# EasyEDA Pro project LeTian-robot2（轮腿机器人）.eprj, schematic Control-SCH
Create Date: 2022-11-02; Page Name: P1; Project Name: LeTian-robot2（轮腿机器人）; Schematic Name: Control-SCH; Update Date: 2023-05-18; Company: LeTian
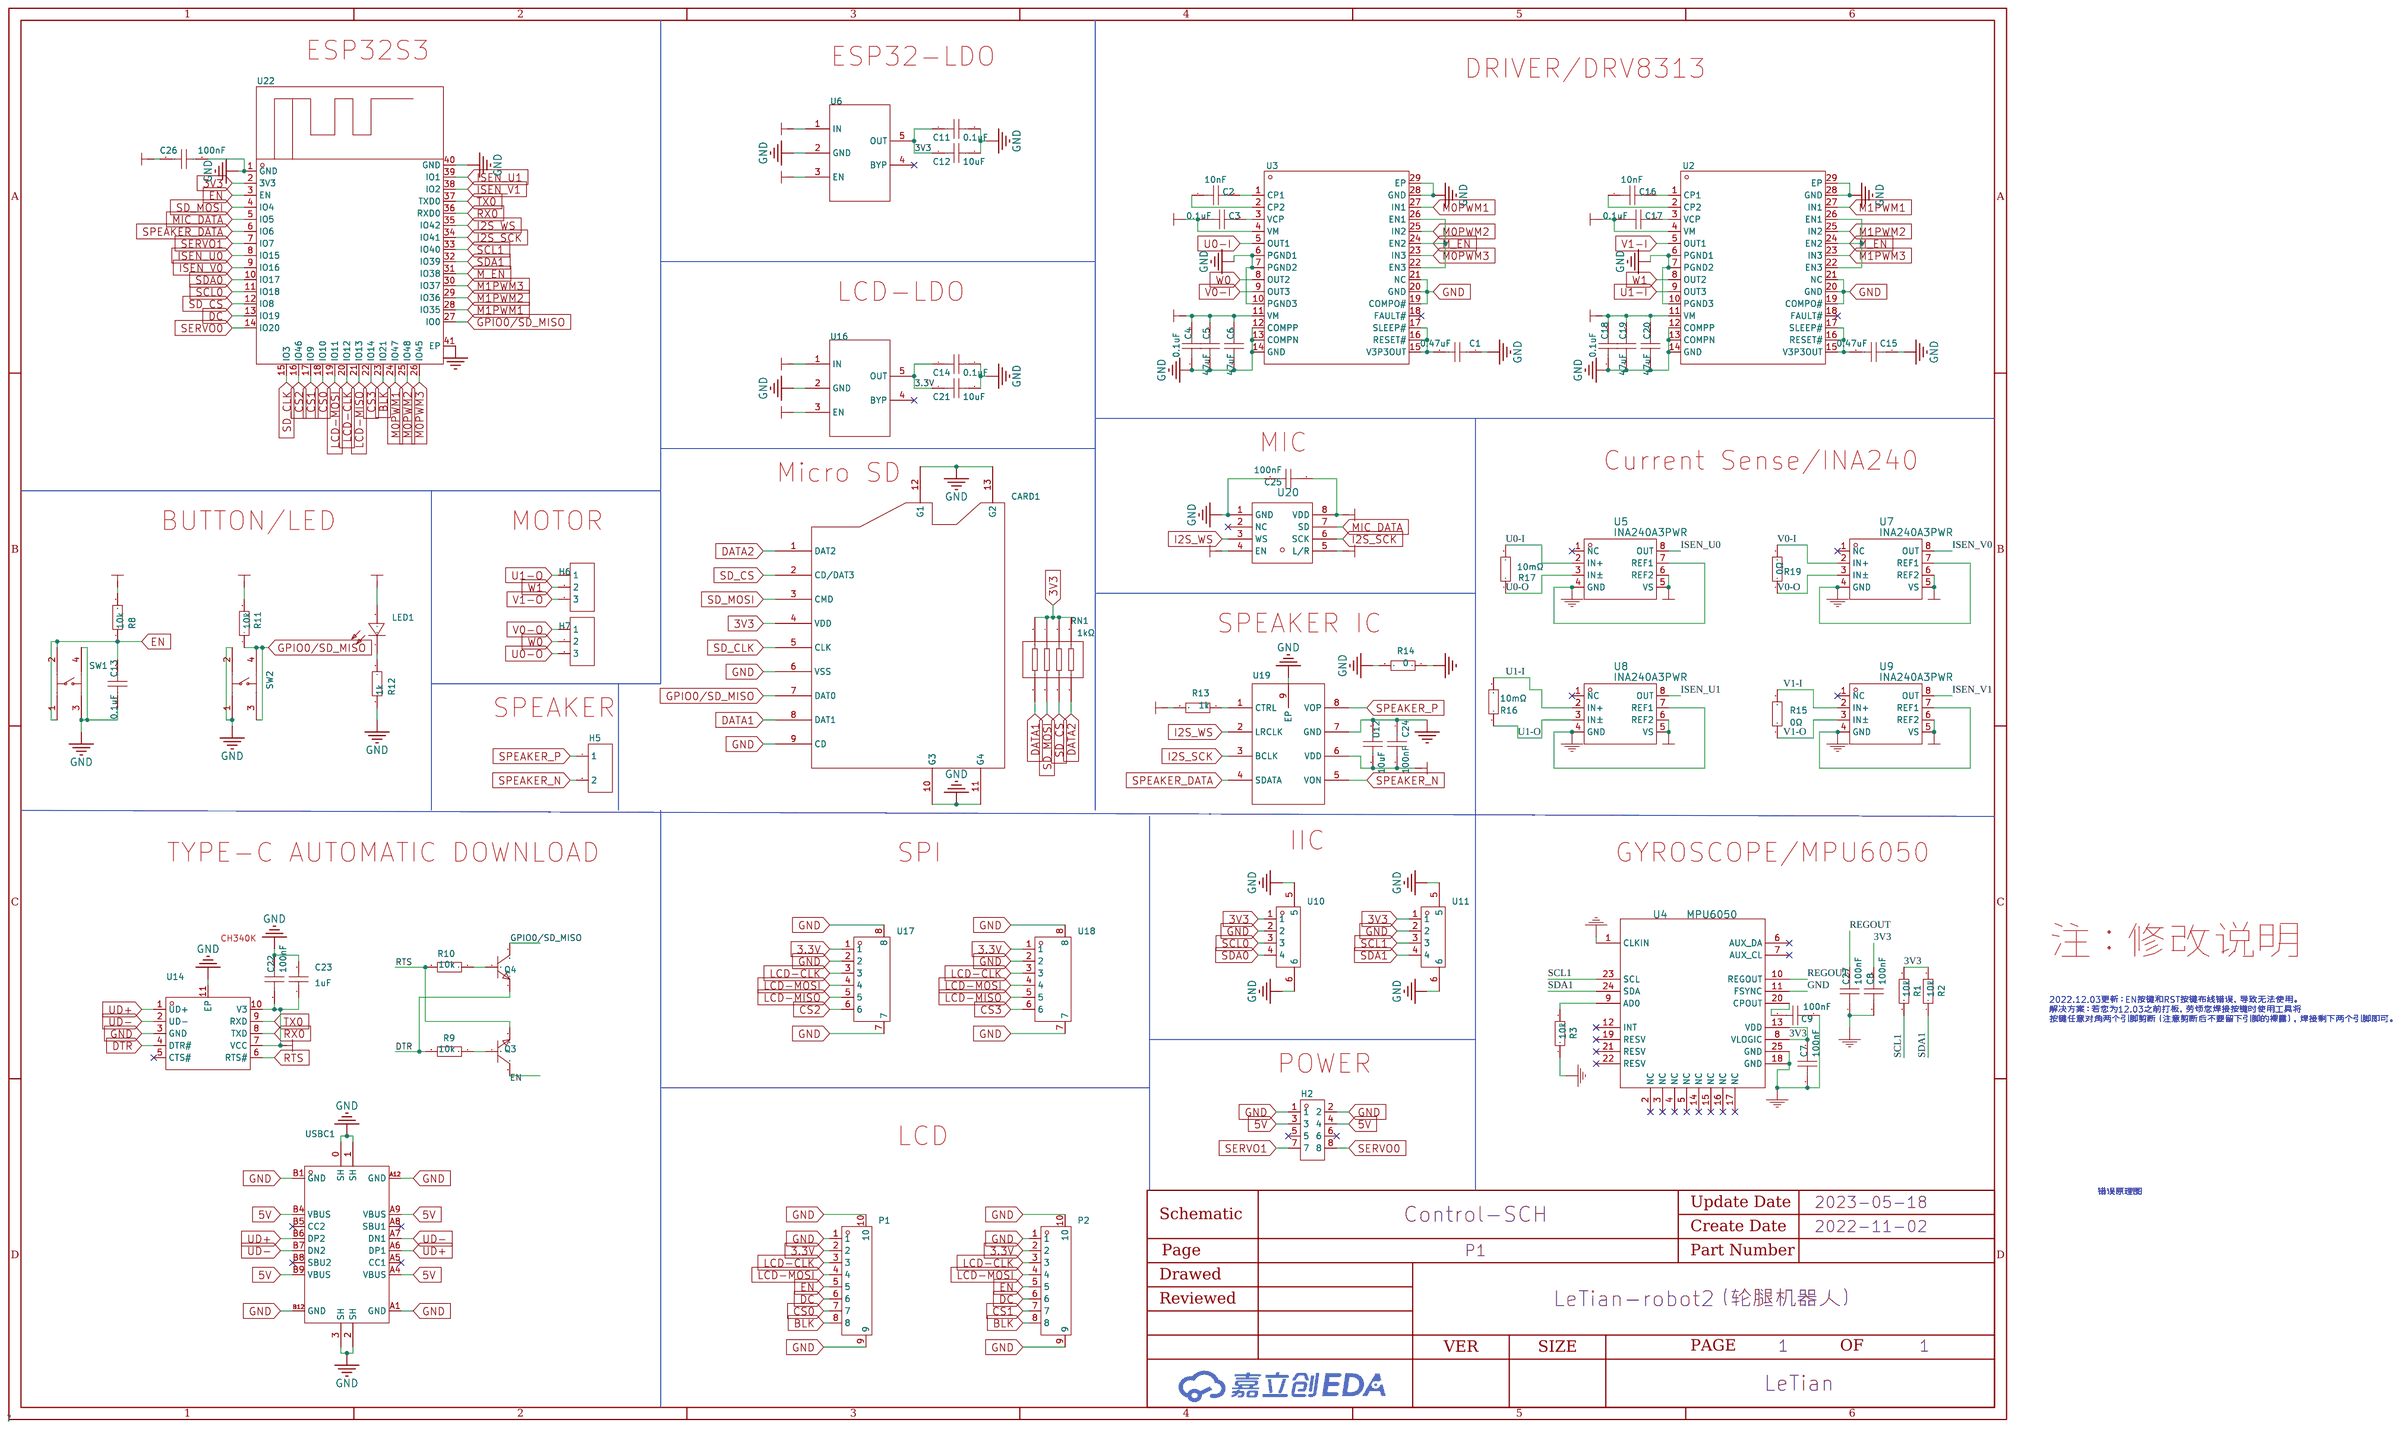
[diagram p1: schematic sheet]

## Parts
C1  0.47uF  [C0603]
C2  10nF  [C0603]
C3  0.1uF  [C0603]
C4  0.1uF  [C0603]
C5  47uF  [C1812]
C6  47uF  [C1812]
C7  100nF  [C0603]
C8  100nF  [C0603]
C9  100nF  [C0603]
C11  0.1uF  [C0603]
C12  10uF  [C0603]
C13  0.1uF  [C0603]
C14  0.1uF  [C0603]
C15  0.47uF  [C0603]
C16  10nF  [C0603]
C17  0.1uF  [C0603]
C18  0.1uF  [C0603]
C19  47uF  [C1812]
C20  47uF  [C1812]
C21  10uF  [C0603]
C22  100nF  [C0603]
C23  1uF  [C0603]
C24  100nF  [C0603]
C25  100nF  [C0603]
C26  100nF  [C0603]
C27  100nF  [C0603]
CARD1  TF-15x15  [TF-SMD_TF-15-15]
H2  2.54-2*4P立贴针  [HDR-SMD_8P-P2.54-V-M-R2-C4-LS7.4]
H5  826629-2  [HDR-TH_2P-P2.54-V-M-1]
H6  2.54-1*3P针  [HDR-TH_3P-P2.54-V-M-1]
H7  2.54-1*3P针  [HDR-TH_3P-P2.54-V-M-1]
LED1  TLMS1100-GS08  [LED0603-RD_RED]
P1  FPC 0.5MM 8P 拉抽式 H2.0mm 下接  [FPC-SMD_8P-P0.50_LSXJ-H2.0-8P]
P2  FPC 0.5MM 8P 拉抽式 H2.0mm 下接  [FPC-SMD_8P-P0.50_LSXJ-H2.0-8P]
Q3  SS8050  [SOT-23-3_L2.9-W1.3-P1.90-LS2.4-BR]
Q4  SS8050  [SOT-23-3_L2.9-W1.3-P1.90-LS2.4-BR]
R1  10k  [R0603]
R2  10k  [R0603]
R3  10k  [R0603]
R8  10k  [R0603]
R9  10k  [R0603]
R10  10k  [R0603]
R11  10k  [R0603]
R12  1k  [R0603]
R13  1k  [R0603]
R14  0  [R0603]
R15  0Ω  [R1206]
R16  10mΩ  [R1206]
R17  10mΩ  [R1206]
R19  0Ω  [R1206]
RN1  1kΩ  [RES-ARRAY-SMD_0603-8P-L3.2-W1.6-BL]
SW1  -  [KEY-SMD_4P-L4.2-W3.2-P2.20-LS5.1-TL]
SW2  -  [KEY-SMD_4P-L4.2-W3.2-P2.20-LS5.1-TL]
U2  DRV8313PWPR  [HTSSOP-28_L9.8-W4.5-P0.65-LS6.6-BL-EP]
U3  DRV8313PWPR  [HTSSOP-28_L9.8-W4.5-P0.65-LS6.6-BL-EP]
U4  MPU6050  [QFN-24_L4.0-W4.0-P0.50-BL-EP2.7]
U5  INA240A3PWR  [TSSOP-8_L4.4-W3.0-P0.65-LS6.4-BL-2]
U6  SPX3819M5-L-3-3/TR  [SOT-23-5_L3.0-W1.7-P0.95-LS2.8-BR]
U7  INA240A3PWR  [TSSOP-8_L4.4-W3.0-P0.65-LS6.4-BL-2]
U8  INA240A3PWR  [TSSOP-8_L4.4-W3.0-P0.65-LS6.4-BL-2]
U9  INA240A3PWR  [TSSOP-8_L4.4-W3.0-P0.65-LS6.4-BL-2]
U10  GH1.25-4PWBPZ  [CONN-SMD_GH1.25-4PWBPZ]
U11  GH1.25-4PWBPZ  [CONN-SMD_GH1.25-4PWBPZ]
U12  10uF  [C0603]
U14  CH340K  [ESOP-10_L4.9-W3.9-P1.00-LS6.2-BL-EP]
U16  SPX3819M5-L-3-3/TR  [SOT-23-5_L3.0-W1.7-P0.95-LS2.8-BR]
U17  1.25-6PWTDK  [CONN-SMD_6P-P1.25_GH1.25-6PWBPZ]
U18  1.25-6PWTDK  [CONN-SMD_6P-P1.25_GH1.25-6PWBPZ]
U19  -  [NS4168-eSOP8]
U20  -  [MSM-MIC]
U22  ESP32-S3-WROOM-1-N8  [WIFIM-SMD_ESP32-S3-WROOM-1-N8]
USBC1  TYPE-C-31-M-12  [USB-C_SMD-TYPE-C-31-M-12]

## Library data of the parts
C1 C15 = CL10B104KB8NNNC: 容值:100nF;精度:±10%;额定电压:50V;材质(温度系数):X7R;; LCSC Part Name: 100nF ±10% 50V; Supplier Part: C694503; Manufacturer: SAMSUNG(三星); Supplier Footprint: 0603; JLCPCB Part Class: Extended Part; Datasheet: https://atta.szlcsc.com/upload/public/pdf/source/20160103/1457707680512.pdf; Supplier: LCSC; Tolerance: ±10%; Voltage Rated: 50V; Temperature Coefficient: X7R
C2 C16 = CL10B104KB8NNNC: 容值:100nF;精度:±10%;额定电压:50V;材质(温度系数):X7R;; LCSC Part Name: 100nF ±10% 50V; Supplier Part: C346187; Manufacturer: SAMSUNG(三星); Supplier Footprint: 0603; JLCPCB Part Class: Extended Part; Datasheet: https://atta.szlcsc.com/upload/public/pdf/source/20160103/1457707680512.pdf; Supplier: LCSC; Tolerance: ±10%; Voltage Rated: 50V; Temperature Coefficient: X7R
C3 C4 C11 C13 C14 C17 C18 = CL10B104KB8NNNC: 容值:100nF;精度:±10%;额定电压:50V;材质(温度系数):X7R;; LCSC Part Name: 100nF ±10% 50V; Supplier Part: C282519; Manufacturer: SAMSUNG(三星); Supplier Footprint: 0603; JLCPCB Part Class: Extended Part; Datasheet: https://atta.szlcsc.com/upload/public/pdf/source/20160103/1457707680512.pdf; Supplier: LCSC; Tolerance: ±10%; Voltage Rated: 50V; Temperature Coefficient: X7R
C5 C6 C19 C20 = FH12X222K302EGG: 等级:X2;容值:2.2nF;精度:±10%;; LCSC Part Name: 等级:X2 2.2nF ±10%; Supplier Part: C342632; Manufacturer: PSA(信昌电陶); Supplier Footprint: 1812; JLCPCB Part Class: Extended Part; Datasheet: https://atta.szlcsc.com/upload/public/pdf/source/20200506/C436246_4EAA78C9048D88437BAF2CB7B8BE45FD.pdf; Supplier: LCSC; Subclass: X2; Tolerance: ±10%
C7-C9 C22 C24-C27 = 0603F104Z500CT_C83060: 容值:100nF;精度:-20%~+80%;额定电压:50V;材质(温度系数):Y5V;; LCSC Part Name: 100nF -20%~+80% 50V; Supplier Part: C282519; Manufacturer: Walsin(华新科); Manufacturer Part: 0603F104Z500CT; Supplier Footprint: 0603; JLCPCB Part Class: Extended Part; Datasheet: https://atta.szlcsc.com/upload/public/pdf/source/20161119/1479540179445.pdf; Supplier: LCSC; Tolerance: -20%~+80%; Voltage Rated: 50V; Temperature Coefficient: Y5V
C12 C21 = CL10B104KB8NNNC: 容值:100nF;精度:±10%;额定电压:50V;材质(温度系数):X7R;; LCSC Part Name: 100nF ±10% 50V; Supplier Part: C669868; Manufacturer: SAMSUNG(三星); Supplier Footprint: 0603; JLCPCB Part Class: Extended Part; Datasheet: https://atta.szlcsc.com/upload/public/pdf/source/20160103/1457707680512.pdf; Supplier: LCSC; Tolerance: ±10%; Voltage Rated: 50V; Temperature Coefficient: X7R
C23 = 0603F105M160NT: 容值:1uF;精度:±20%;额定电压:16V;材质(温度系数):Y5V;; LCSC Part Name: 1uF ±20% 16V; Supplier Part: C1689; Manufacturer: FH(风华); Supplier Footprint: 0603; JLCPCB Part Class: Extended Part; Datasheet: https://atta.szlcsc.com/upload/public/pdf/source/20170923/C1689_1506149319442988473.pdf; Supplier: LCSC; Tolerance: ±20%; Voltage Rated: 16V; Temperature Coefficient: Y5V
CARD1 = TF-15x15: 卡连接方式:自弹式;卡类型:MicroSD卡(TF卡);连接器类型:卡座;本体最大高度:-;触头材质:-;触头镀层:-;工作温度范围:-;焊接温度(最大值):-;; LCSC Part Name: 自弹式 MicroSD卡(TF卡) 卡座; Supplier Part: C111196; Manufacturer: SOFNG(硕方); Supplier Footprint: SMD; JLCPCB Part Class: Extended Part; Datasheet: https://atta.szlcsc.com/upload/public/pdf/source/20200911/C111196_6985EA70490FD8F56A5C3F4D017F3786.pdf; Supplier: LCSC; Card Connection Mode: 自弹式; Card Type: MicroSD卡(TF卡); Connector Type: 卡座
H2 = 2.54-2*4P立贴针: 间距:2.54mm;总PIN位数:8;排数:2;插针结构:-;行距:-;安装类型:-;圆针/方针:-;额定电流:-;额定电压:-;配合针长度:-;塑高:-;触头材质:-;触头镀层:-;颜色:黑色;; LCSC Part Name: 2.54mm; Supplier Part: C192300; Manufacturer: BOOMELE(博穆精密); Supplier Footprint: SMD,P=2.54mm; JLCPCB Part Class: Extended Part; Datasheet: https://atta.szlcsc.com/upload/public/pdf/source/20210812/F9D0E068B6990BF98BEA9D68FBD6ED36.pdf; Supplier: LCSC; Pitch: 2.54mm; Number of Pins: 8; Number of Rows: 2; Color: 黑色
H5 = 826629-2: 间距:2.54mm;总PIN位数:2;排数:1;插针结构:1x2P;行距:-;安装类型:直插;圆针/方针:-;额定电流:-;额定电压:-;配合针长度:-;塑高:2.8mm;触头材质:黄铜;触头镀层:-;颜色:绿色;; LCSC Part Name: 2.54mm 1x2P 直插 分离式  金; Supplier Part: C86471; Manufacturer: TE Connectivity(美国泰科); Supplier Footprint: 插件,P=2.54mm; JLCPCB Part Class: Extended Part; Datasheet: https://atta.szlcsc.com/upload/public/pdf/source/20161105/1478330325829.pdf; Supplier: LCSC; Pitch: 2.54mm; Number of Pins: 2; Number of Rows: 1; Pin Structure: 1x2P; Mounting Type: 直插; Insulation Height: 2.8mm; Contact Material: 黄铜; Color: 绿色
H6 H7 = 2.54-1*3P针: 间距:2.54mm;总PIN位数:3;排数:1;插针结构:1x3P;行距:-;安装类型:直插;圆针/方针:方针;额定电流:3A;额定电压:-;配合针长度:-;塑高:-;端接针长度:-;触头材质:-;触头镀层:-;工作温度范围:-40~+105;颜色:黑色;; LCSC Part Name: 2.54mm 1x3P 直插 方针; Supplier Part: C49257; Manufacturer: BOOMELE(博穆精密); Supplier Footprint: 插件,P=2.54mm; JLCPCB Part Class: Extended Part; Datasheet: https://atta.szlcsc.com/upload/public/pdf/source/20151109/1457707570948.pdf; Supplier: LCSC; Pitch: 2.54mm; Number of Pins: 3; Number of Rows: 1; Pin Structure: 1x3P; Mounting Type: 直插; Circluar Pins/Square Pins: 方针; Current Rating (Max): 3A; Operating Temperature Range: -40~+105; Color: 黑色
LED1 = TLMS1100-GS08: 发光颜色:红灯;; Supplier Part: C965807; Manufacturer: VISHAY(威世); Supplier Footprint: 0603; JLCPCB Part Class: Extended Part; Datasheet: https://atta.szlcsc.com/upload/public/pdf/source/20181008/C266784_DA83D7B059AAF2F8B2E0AECEC66B2294.pdf; Supplier: LCSC; Emitted Color: 红灯
P1 P2 = FPC 0.5MM 8P 拉抽式 H2.0mm 下接: 间距:0.5mm;触点数量:8;锁定特性:抽屉式;安装类型:卧贴;触点类型:下接;; LCSC Part Name: 0.5mm P数:8 抽屉式 下接 停产; Supplier Part: C11049; Manufacturer: BOOMELE(博穆精密); Supplier Footprint: SMD,P=0.5mm; JLCPCB Part Class: Extended Part; Datasheet: https://atta.szlcsc.com/upload/public/pdf/source/20190828/C11049_0B9C6D9328AA774B9FE15F21DB05D521.pdf; Supplier: LCSC; Pitch: 0.5mm; Number of Contacts: 8; Locking Feature: 抽屉式; Mounting Type: 卧贴; Contact Type: 下接; Height Above Board: 2mm
Q3 Q4 = SS8050_C916392: 晶体管类型:-;集射极击穿电压(Vceo):-;集电极电流(Ic):-;功率(Pd):-;集电极截止电流(Icbo):-;集电极-发射极饱和电压(VCE(sat)@Ic,Ib):-;直流电流增益(hFE@Ic,Vce):-;特征频率(fT):-;; Supplier Part: C916392; Manufacturer: JSMSEMI(杰盛微); Supplier Footprint: SOT-23; JLCPCB Part Class: Extended Part; Datasheet: https://atta.szlcsc.com/upload/public/pdf/source/20211201/0A8CEC4FF7E91679BCF495428691A716.pdf; Supplier: LCSC
R1-R3 R8-R13 = TR0603B10K0P0525Z: 电阻类型:薄膜电阻;阻值:10k;精度:±0.1%;功率:100mW;温度系数:±25ppm/;最大工作电压:75V;工作温度范围:-55~+155;; LCSC Part Name: 10k ±0.1% 100mW; Supplier Part: C25804; Manufacturer: EVER OHMS(天二科技); Supplier Footprint: 0603; JLCPCB Part Class: Extended Part; Datasheet: https://atta.szlcsc.com/upload/public/pdf/source/20190415/C188363_433BF05B6FB8F7A0F5F35A3E4390C55A.pdf; Supplier: LCSC; Type: 薄膜电阻; Tolerance: ±0.1%; Power(Watts): 100mW; Temperature Coefficient: ±25ppm/; Overload Voltage (Max): 75V; Operating Temperature Range: -55~+155
R14 = TR0603B10K0P0525Z: 电阻类型:薄膜电阻;阻值:10k;精度:±0.1%;功率:100mW;温度系数:±25ppm/;最大工作电压:75V;工作温度范围:-55~+155;; LCSC Part Name: 10k ±0.1% 100mW; Supplier Part: C242160; Manufacturer: EVER OHMS(天二科技); Supplier Footprint: 0603; JLCPCB Part Class: Extended Part; Datasheet: https://atta.szlcsc.com/upload/public/pdf/source/20190415/C188363_433BF05B6FB8F7A0F5F35A3E4390C55A.pdf; Supplier: LCSC; Type: 薄膜电阻; Tolerance: ±0.1%; Power(Watts): 100mW; Temperature Coefficient: ±25ppm/; Overload Voltage (Max): 75V; Operating Temperature Range: -55~+155
R15-R17 R19 = RK73Z2BTTD: 阻值:0Ω;精度:-;功率:-;工作温度范围:-55~+155;; LCSC Part Name: 0Ω 0; Supplier Part: C131706; Manufacturer: KOA; Supplier Footprint: 1206; JLCPCB Part Class: Extended Part; Datasheet: https://atta.szlcsc.com/upload/public/pdf/source/20170918/C131706_1505727048923976489.pdf; Supplier: LCSC; Operating Temperature Range: -55~+155
RN1 = EXB38V102JV: 阻值:1kΩ;单个元件功率:63mW;电阻器数:4;引脚数:8;; LCSC Part Name: 1kΩ ±5%; Supplier Part: C160614; Manufacturer: PANASONIC(松下); Supplier Footprint: 1206; JLCPCB Part Class: Extended Part; Datasheet: https://atta.szlcsc.com/upload/public/pdf/source/20180511/C192512_56D870360DEB9F31BF07F5772A6396FE.pdf; Supplier: LCSC; Power(Watts): 63mW; Number of Resistors: 4; Number of Pins: 8
SW1 SW2 = K2-1808GN-A4SW-04: 触点电流:50mA;额定电压(DC):12V;绝缘电阻:100M;电路结构:单刀单掷;安装方式:立贴;按钮形状:椭圆形按钮;带灯:-;作用力:250gf@±30gf;机械寿命:100000;工作温度:-25~+85;开关长度:4.2mm;开关宽度:3.25mm;开关高度:2.5mm;; Supplier Part: C283535; Manufacturer: 韩国韩荣; Supplier Footprint: SMD; JLCPCB Part Class: Extended Part; Datasheet: https://atta.szlcsc.com/upload/public/pdf/source/20180927/C283535_7E7907F3E7B6C1691E1DC87E363D082A.pdf; Supplier: LCSC; Contact Current: 50mA; Voltage Rating (DC): 12V; Insulation Resistance: 100M; Circuit: 单刀单掷; Mounting Style: 立贴; Actuator Style: 椭圆形按钮; Operating Force: 250gf@±30gf; Mechanical Life: 100000; Operating Temperature: -25~+85; Switch Length: 4.2mm; Switch Width: 3.25mm; Switch Height: 2.5mm
U2 U3 = DRV8313PWPR: DRV8313 三路 1/2 H 桥驱动器 IC; Supplier Part: C92482; Manufacturer: TI(德州仪器); Supplier Footprint: HTSSOP-28; JLCPCB Part Class: Extended Part; Datasheet: https://atta.szlcsc.com/upload/public/pdf/source/20180307/C92482_15204091381071407760.pdf; Supplier: LCSC
U4 = MPU6050: Manufacturer Part: C24112
U5 U7-U9 = INA240A3PWR: link: https://item.szlcsc.com/109288.html; 3DModel: TSSOP-8_L3.0-W4.4-H1.0-LS6.4-P0.65; Supplier: LCSC; Supplier Part: C544538; Manufacturer: TI(德州仪器); JLCPCB Part Class: Extended Part
U6 U16 = SPX3819M5-L-3-3/TR: 输出类型:固定;输出极性:正;输出通道数:1;最大输入电压:16V;输出电压:3.3V;压差:700mV@(500mA);输出电流:500mA;电源纹波抑制比(PRSS):70dB;; LCSC Part Name: Vin=16V Vout=3.3V 500mA 70dB; Supplier Part: C9055; Manufacturer: MaxLinear; Supplier Footprint: SOT-23-5; JLCPCB Part Class: Extended Part; Datasheet: https://atta.szlcsc.com/upload/public/pdf/source/20160421/1461205045150.pdf; Supplier: LCSC; Output Type: 固定; Output Polarity: 正; Number of Outputs: 1; Maximum Input Voltage: 16V; Output Voltage: 3.3V; Dropout Voltage: 700mV@(500mA); Output Current: 500mA; Power Supply Rejection Ratio (PRSS): 70dB
U10 U11 = GH1.25-4PWBPZ: LCSC Part Name: GH1.25-4P卧贴编带; Supplier Part: C2829253; Manufacturer: BOOMELE(博穆精密); JLCPCB Part Class: Extended Part; Datasheet: https://atta.szlcsc.com/upload/public/pdf/source/20211125/08A09A4909F58AF780B71FE423A00F7E.pdf; Supplier: LCSC
U12 = GRM188C80G106KE47D: 容值:10uF;精度:±10%;额定电压:-;材质(温度系数):-;; LCSC Part Name: 10uF ±10%; Supplier Part: C669868; Manufacturer: muRata(村田); Supplier Footprint: 0603; JLCPCB Part Class: Extended Part; Datasheet: https://atta.szlcsc.com/upload/public/pdf/source/20210205/C710916_8901BCC8D8E6CC54F2C999D22152DEF1.pdf; Supplier: LCSC; Tolerance: ±10%
U14 = CH340K: 类型:-;协议类别:-;驱动器/接收器数:-;数据速率:-;; Supplier Part: C968586; Manufacturer: WCH(南京沁恒); Supplier Footprint: ESSOP-10; JLCPCB Part Class: Extended Part; Datasheet: https://atta.szlcsc.com/upload/public/pdf/source/20200819/C84681_ADBED554CE321879DBD6B1D06488689C.pdf; Supplier: LCSC
U17 U18 = 1.25-6PWTDK: 间距:1.25mm;插针结构:1x6P;排数:1;每排PIN数:6;公母:公型插针;安装方式:卧贴;额定电流:1A;工作温度范围:-25~+85;; LCSC Part Name: 1.25mm 1x6P 卧贴 1.25间距 6P卧贴 带扣; Supplier Part: C3008556; Manufacturer: SHOU HAN(首韩); Supplier Footprint: SMD,P=1.25mm; JLCPCB Part Class: Extended Part; Datasheet: https://atta.szlcsc.com/upload/public/pdf/source/20220922/08E151A46DB8C35F4E0E57B149835426.pdf; Supplier: LCSC; Pitch: 1.25mm; Pins Structure: 1x6P; Number of Rows: 1; Number of PINs Per Row: 6; Gender: 公型插针; Mounting Style: 卧贴; Current Rating (Max): 1A; Operating Temperature Range: -25~+85
U19 = ns4168
U20 = MSM261S4030H0
U22 = ESP32-S3-WROOM-1-N8: Supplier Part: C2913198; Manufacturer: ESPRESSIF(乐鑫); Supplier Footprint: 模块; JLCPCB Part Class: Extended Part; Datasheet: https://atta.szlcsc.com/upload/public/pdf/source/20221026/9A44C6421221D672346AAE72DF9F8146.pdf; Supplier: LCSC
USBC1 = TYPE-C-31-M-12: 连接器类型:Type-C;标准:-;公母:母座;触点数量:16;端口数量:1;安装方式:-;额定电流 - 电源:5A;触头材质:-;触头镀层:-;工作温度范围:-;焊接温度(最大值):-;; LCSC Part Name: Type-C 母座; Supplier Part: C165948; Manufacturer: 韩国韩荣; Supplier Footprint: SMD; JLCPCB Part Class: Extended Part; Datasheet: https://atta.szlcsc.com/upload/public/pdf/source/20220525/466408E853115E789EDB0DDC29077C05.pdf; Supplier: LCSC; Connector Type: Type-C; Gender: 母座; Number of Contacts: 16; Number of Ports: 1; Current Rating - Power (Max): 5A

## Nets
3.3V: C14.1 C21.1 P1.2 P2.2 U16.5(OUT) U17.1 U18.1
3V3: C7.2 C8.2 C11.1 C12.1 C22.1 C23.1 C25.1 C26.1 CARD1.4(VDD) LED1.2(A) R1.2 R2.2 R8.2 R11.2 R13.2 RN1.5 RN1.6 RN1.7 RN1.8 U4.8(VLOGIC) U4.13(VDD) U5.5(VS) U5.6(REF2) U6.5(OUT) U7.5(VS) U7.6(REF2) U8.5(VS) U8.6(REF2) U9.5(VS) U9.6(REF2) U10.1 U11.1 U14.7(VCC) U14.10(V3) U20.4(EN) U20.5(L/R) U20.8(VDD) U22.2(3V3)
5V: C24.2 H2.3 H2.4 U6.1(IN) U6.3(EN) U12.2 U16.1(IN) U16.3(EN) U19.6(VDD) USBC1.A4(VBUS) USBC1.A9(VBUS) USBC1.B4(VBUS) USBC1.B9(VBUS)
AGND: C24.1 R14.1 U12.1 U19.7(GND)
GND: C1.1 C4.1 C5.1 C6.1 C7.1 C8.1 C9.1 C11.2 C12.2 C13.1 C14.2 C15.1 C18.1 C19.1 C20.1 C21.2 C22.2 C23.2 C25.2 C26.2 C27.1 CARD1.6(VSS) CARD1.9(CD) CARD1.10(G3) CARD1.11(G4) CARD1.12(G1) CARD1.13(G2) H2.1 H2.2 P1.1 P1.9 P1.10 P2.1 P2.9 P2.10 R3.1 R12.1 R14.2 SW1.3 SW1.4 SW2.1 SW2.2 U2.6(PGND1) U2.7(PGND2) U2.10(PGND3) U2.12(COMPP) U2.13(COMPN) U2.14(GND) U2.19(COMPO#) U2.20(GND) U2.21(NC) U2.28(GND) U2.29(EP) U3.6(PGND1) U3.7(PGND2) U3.10(PGND3) U3.12(COMPP) U3.13(COMPN) U3.14(GND) U3.19(COMPO#) U3.20(GND) U3.21(NC) U3.28(GND) U3.29(EP) U4.1(CLKIN) U4.11(FSYNC) U4.18(GND) U4.25(GND) U5.4(GND) U5.7(REF1) U6.2(GND) U7.4(GND) U7.7(REF1) U8.4(GND) U8.7(REF1) U9.4(GND) U9.7(REF1) U10.2 U10.5 U10.6 U11.2 U11.5 U11.6 U14.3(GND) U14.11(EP) U16.2(GND) U17.2 U17.7 U17.8 U18.2 U18.7 U18.8 U19.9(EP) U20.1(GND) U22.1(GND) U22.40(GND) U22.41(EP) USBC1.0(SH) USBC1.1(SH) USBC1.2(SH) USBC1.3(SH) USBC1.A1(GND) USBC1.A12(GND) USBC1.B1(GND) USBC1.B12(GND)
V0-I: R19.2 U3.9(OUT3) U7.2(IN+)
V0-O: H7.1 R19.1 U7.3(IN±)
V1-I: R15.2 U2.5(OUT1) U9.2(IN+)
V1-O: H6.3 R15.1 U9.3(IN±)
VCC: C3.1 C4.2 C5.2 C6.2 C17.1 C18.2 C19.2 C20.2 U2.4(VM) U2.11(VM) U3.4(VM) U3.11(VM)
BLK: P1.8 P2.8 U22.23(IO21)
CS0: P1.7 U22.18(IO10)
CS1: P2.7 U22.17(IO9)
CS2: U17.6 U22.16(IO46)
CS3: U18.6 U22.22(IO14)
DATA1: CARD1.8(DAT1) RN1.1
DATA2: CARD1.1(DAT2) RN1.4
DC: P1.6 P2.6 U22.13(IO19)
DTR: Q4.2(E) R9.2 U14.4(DTR#)
EN: C13.2 P1.5 P2.5 Q3.3(C) R8.1 SW1.1 SW1.2 U22.3(EN)
GPIO0/SD_MISO: CARD1.7(DAT0) Q4.3(C) R11.1 SW2.3 SW2.4 U22.27(IO0)
I2S_SCK: U19.3(BCLK) U20.6(SCK) U22.34(IO41)
I2S_WS: U19.2(LRCLK) U20.3(WS) U22.35(IO42)
ISEN_U0: U5.8(OUT) U22.8(IO15)
ISEN_U1: U8.8(OUT) U22.39(IO1)
ISEN_V0: U7.8(OUT) U22.9(IO16)
ISEN_V1: U9.8(OUT) U22.38(IO2)
LCD-CLK: P1.3 P2.3 U17.3 U18.3 U22.20(IO12)
LCD-MISO: U17.5 U18.5 U22.21(IO13)
LCD-MOSI: P1.4 P2.4 U17.4 U18.4 U22.19(IO11)
M0PWM1: U3.27(IN1) U22.24(IO47)
M0PWM2: U3.25(IN2) U22.25(IO48)
M0PWM3: U3.23(IN3) U22.26(IO45)
M1PWM1: U2.27(IN1) U22.28(IO35)
M1PWM2: U2.25(IN2) U22.29(IO36)
M1PWM3: U2.23(IN3) U22.30(IO37)
M_EN: U2.22(EN3) U2.24(EN2) U2.26(EN1) U3.22(EN3) U3.24(EN2) U3.26(EN1) U22.31(IO38)
MIC_DATA: U20.7(SD) U22.5(IO5)
REGOUT: C27.2 U4.10(REGOUT)
RTS: Q3.2(E) R10.2 U14.6(RTS#)
RX0: U14.8(TXD) U22.36(RXD0)
SCL0: U10.3 U22.11(IO18)
SCL1: R1.1 U4.23(SCL) U11.3 U22.33(IO40)
SD_CLK: CARD1.5(CLK) U22.15(IO3)
SD_CS: CARD1.2(CD/DAT3) RN1.3 U22.12(IO8)
SD_MOSI: CARD1.3(CMD) RN1.2 U22.4(IO4)
SDA0: U10.4 U22.10(IO17)
SDA1: R2.1 U4.24(SDA) U11.4 U22.32(IO39)
SERVO0: H2.8 U22.14(IO20)
SERVO1: H2.7 U22.7(IO7)
SPEAKER_DATA: U19.4(SDATA) U22.6(IO6)
SPEAKER_N: H5.2 U19.5(VON)
SPEAKER_P: H5.1 U19.8(VOP)
TX0: U14.9(RXD) U22.37(TXD0)
U0-I: R17.2 U3.5(OUT1) U5.2(IN+)
U0-O: H7.3 R17.1 U5.3(IN±)
U1-I: R16.2 U2.9(OUT3) U8.2(IN+)
U1-O: H6.1 R16.1 U8.3(IN±)
UD+: U14.1(UD+) USBC1.A6(DP1) USBC1.B6(DP2)
UD-: U14.2(UD-) USBC1.A7(DN1) USBC1.B7(DN2)
W0: H7.2 U3.8(OUT2)
W1: H6.2 U2.8(OUT2)
$1N1352: C15.2 U2.15(V3P3OUT) U2.16(RESET#) U2.17(SLEEP#)
$1N1354: C16.2 U2.1(CP1)
$1N1355: C16.1 U2.2(CP2)
$1N1356: C17.2 U2.3(VCP)
$1N3339: C1.2 U3.15(V3P3OUT) U3.16(RESET#) U3.17(SLEEP#)
$1N3341: C2.2 U3.1(CP1)
$1N3342: C2.1 U3.2(CP2)
$1N3343: C3.2 U3.3(VCP)
$1N4664: C9.2 U4.20(CPOUT)
$1N4673: R3.2 U4.9(AD0)
$1N9396: Q4.1(B) R10.1
$1N9397: Q3.1(B) R9.1
$1N60106: LED1.1(C) R12.2
$1N83130: R13.1 U19.1(CTRL)

Not connected (* = marked no-connect by the designer): H2 5* 6*; U2 18(FAULT#)*; U3 18(FAULT#)*; U4 2(NC)* 3(NC)* 4(NC)* 5(NC)* 6(AUX_DA)* 7(AUX_CL)* 12(INT)* 14(NC)* 15(NC)* 16(NC)* 17(NC)* 19(RESV)* 21(RESV)* 22(RESV)*; U5 1(NC)*; U6 4(BYP)*; U7 1(NC)*; U8 1(NC)*; U9 1(NC)*; U14 5(CTS#)*; U16 4(BYP)*; U20 2(NC)*; USBC1 A5(CC1)* A8(SBU1)* B5(CC2)* B8(SBU2)*

## Notes on the sheet
- ESP32S3
- ESP32-LDO
- DRIVER/DRV8313
- LCD-LDO
- MIC
- Micro SD
- Current Sense/INA240
- BUTTON/LED
- MOTOR
- SPEAKER IC
- SPEAKER
- IIC
- TYPE-C AUTOMATIC DOWNLOAD
- SPI
- GYROSCOPE/MPU6050
- CH340K
- 注：修改说明
- 2022.12.03更新：EN按键和RST按键布线错误，导致无法使用。
  解决方案：若您为12.03之前打板，劳烦您焊接按键时使用工具将
  按键任意对角两个引脚剪断（注意剪断后不要留下引脚的裸露），焊接剩下两个引脚即可。
- POWER
- LCD
- 错误原理图
